# EAGLE design gotek_adapter (EAGLE 7.5.0)
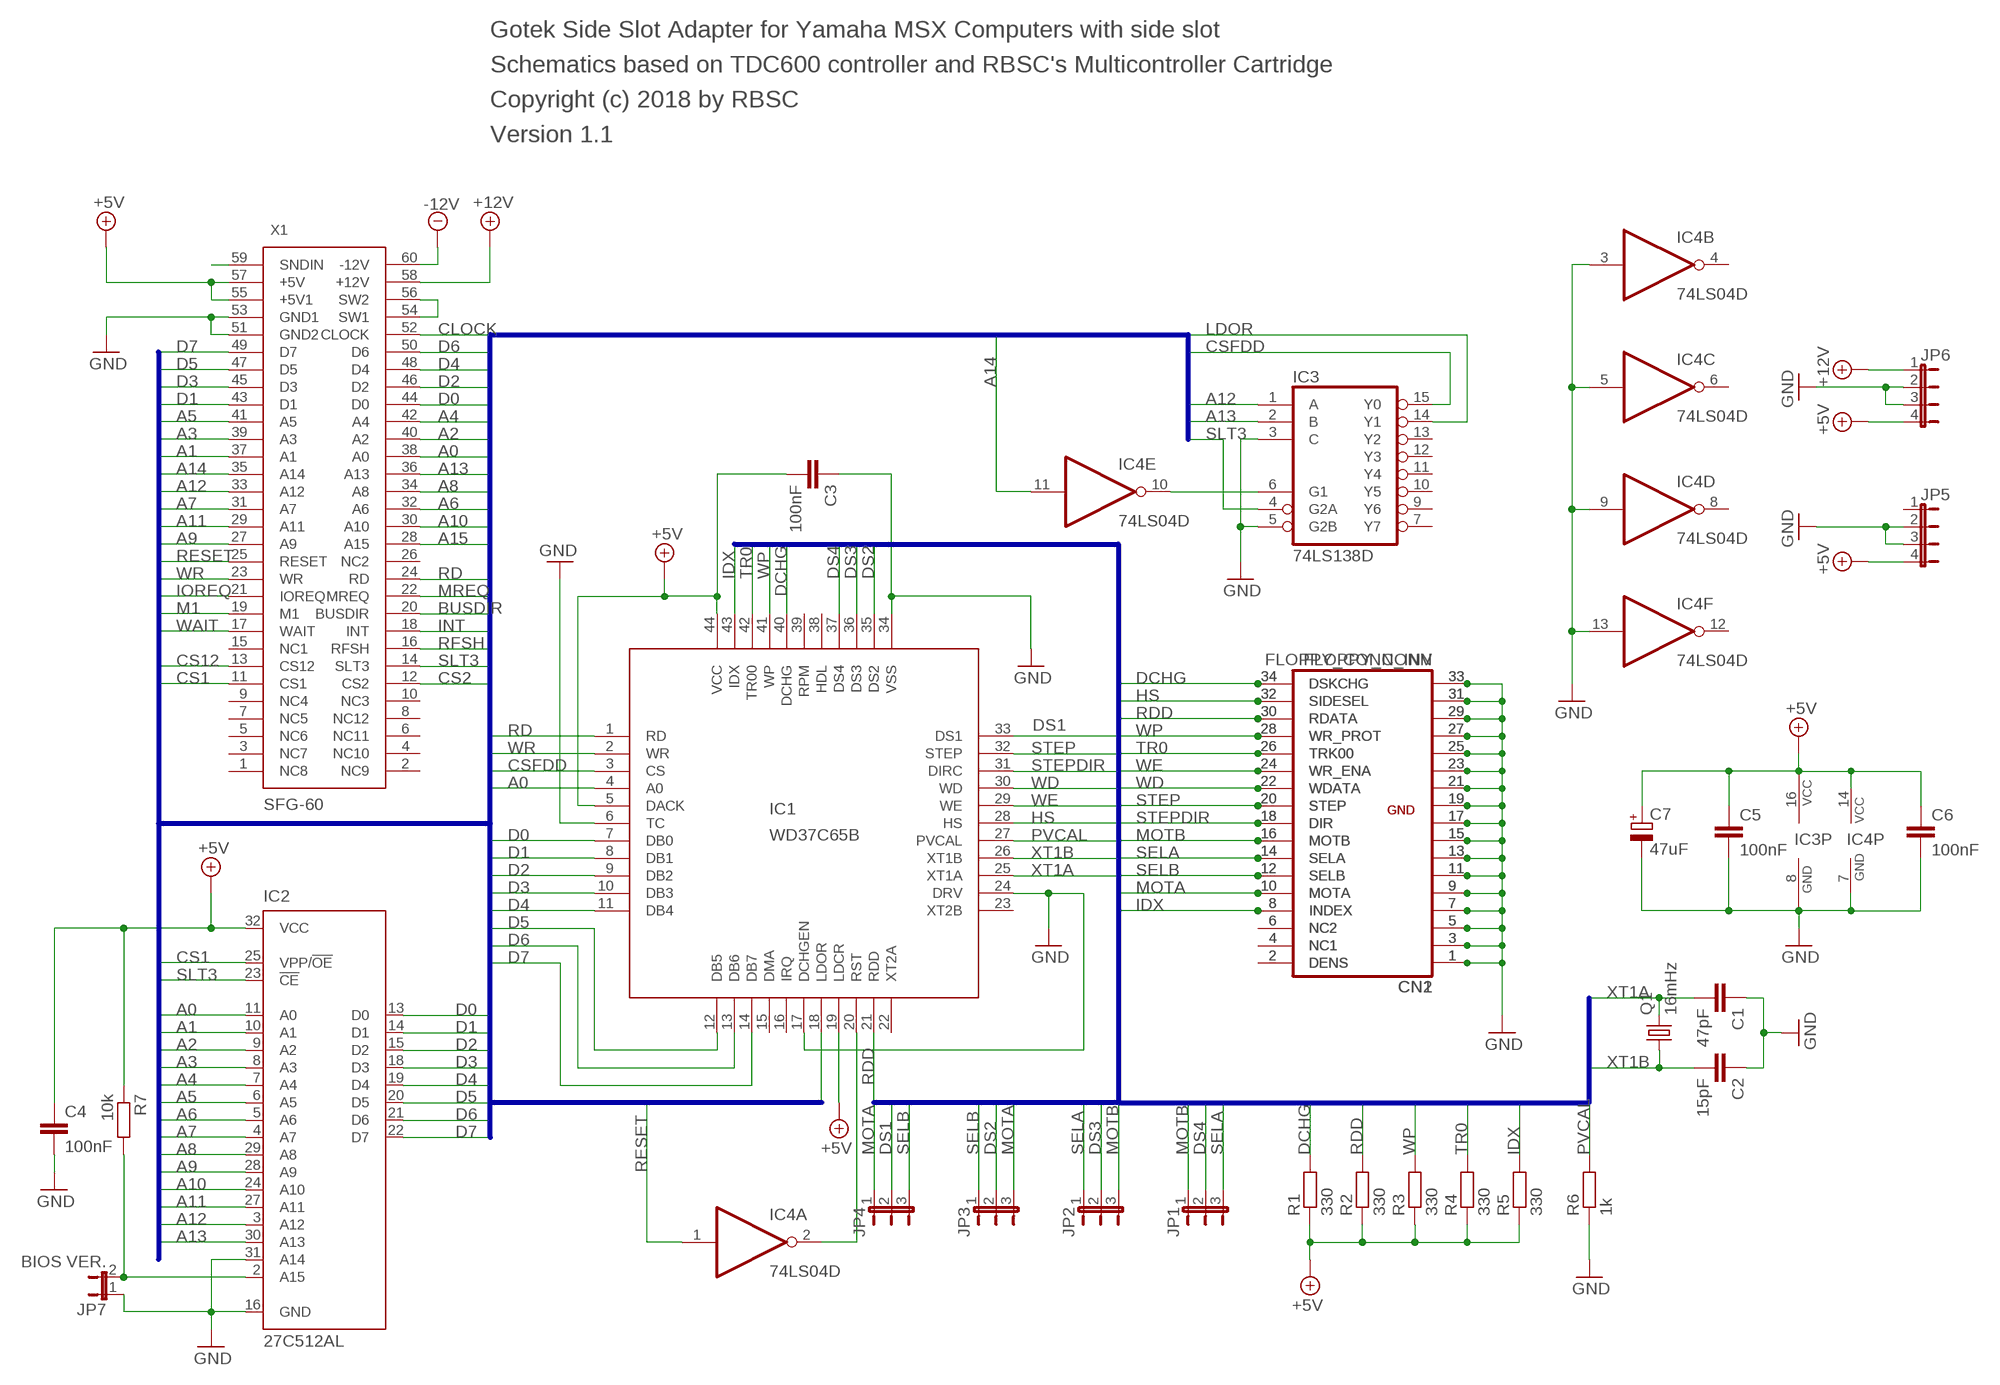
[diagram p0: schematic, sheet 1]

## Parts
C1  47pF  C-EUC0805  [C0805]
C2  15pF  C-EUC0805  [C0805]
C3  100nF  C-EUC0805  [C0805]
C4  100nF  C-EUC0805  [C0805]
C5  100nF  C-EUC0805  [C0805]
C6  100nF  C-EUC0805  [C0805]
C7  47uF  CPOL-EUSMCD  [SMC_D]
CN1  FLOPPY_CONN  [FL_CONN]
CN2  FLOPPY_CONN_INV  [FL_CONN]
IC1  WD37C65B  [PLCC44]
IC2  27C512AL  [PLCC-32]
IC3  74LS138D  [SO16]
IC4  74LS04D  [SO14]
JP1  JP2E  [JP2]
JP2  JP2E  [JP2]
JP3  JP2E  [JP2]
JP4  JP2E  [JP2]
JP5  JP4E  [JP4]
JP6  JP4E  [JP4]
JP7  BIOS VER.  JP1E  [JP1]
Q1  16mHz  CRYSTALHC49S  [HC49/S]
R1  330  R-EU_R0805  [R0805]
R2  330  R-EU_R0805  [R0805]
R3  330  R-EU_R0805  [R0805]
R4  330  R-EU_R0805  [R0805]
R5  330  R-EU_R0805  [R0805]
R6  1k  R-EU_R0805  [R0805]
R7  10k  R-EU_R0805  [R0805]
X1  SFG-60  [SFG-60]

## Nets
+5V: C3.2 C4.1 C5.1 C6.1 C7.+ IC1.5(DACK) IC1.19(LDCR) IC1.44(VCC) IC2.32(VCC) IC3.16(VCC) IC4.14(P:VCC) JP5.4 JP6.4 R1.1 R2.1 R3.1 R4.1 R5.1 R7.1 X1.55(+5V1) X1.57(+5V)
+12V: JP6.1 X1.58(+12V)
-12V: X1.60(-12V)
A0: IC1.4(A0) IC2.11(A0) X1.38(A0)
A1: IC2.10(A1) X1.37(A1)
A2: IC2.9(A2) X1.40(A2)
A3: IC2.8(A3) X1.39(A3)
A4: IC2.7(A4) X1.42(A4)
A5: IC2.6(A5) X1.41(A5)
A6: IC2.5(A6) X1.32(A6)
A7: IC2.4(A7) X1.31(A7)
A8: IC2.29(A8) X1.34(A8)
A9: IC2.28(A9) X1.27(A9)
A10: IC2.24(A10) X1.30(A10)
A11: IC2.27(A11) X1.29(A11)
A12: IC2.3(A12) IC3.1(A) X1.33(A12)
A13: IC2.30(A13) IC3.2(B) X1.36(A13)
A14: IC4.11(E:I) X1.35(A14)
A15: X1.28(A15)
BUSDIR: X1.20(BUSDIR)
CLOCK: X1.52(CLOCK)
CS1: IC2.25(VPP/!OE) X1.11(CS1)
CS2: X1.12(CS2)
CS12: X1.13(CS12)
CSFDD: IC1.3(CS) IC3.15(Y0)
D0: IC1.7(DB0) IC2.13(D0) X1.44(D0)
D1: IC1.8(DB1) IC2.14(D1) X1.43(D1)
D2: IC1.9(DB2) IC2.15(D2) X1.46(D2)
D3: IC1.10(DB3) IC2.18(D3) X1.45(D3)
D4: IC1.11(DB4) IC2.19(D4) X1.48(D4)
D5: IC1.12(DB5) IC2.20(D5) X1.47(D5)
D6: IC1.13(DB6) IC2.21(D6) X1.50(D6)
D7: IC1.14(DB7) IC2.22(D7) X1.49(D7)
DCHG: CN1.34(DSKCHG) CN2.34(DSKCHG) IC1.40(DCHG) R1.2
DS1: IC1.33(DS1) JP4.2
DS2: IC1.35(DS2) JP3.2
DS3: IC1.36(DS3) JP2.2
DS4: IC1.37(DS4) JP1.2
GND: C1.1 C2.1 C3.1 C4.2 C5.2 C6.2 C7.- CN1.1 CN1.3 CN1.5 CN1.7 CN1.9 CN1.11 CN1.13 CN1.15 CN1.17 CN1.19 CN1.21 CN1.23 CN1.25 CN1.27 CN1.29 CN1.31 CN1.33 CN2.1 CN2.3 CN2.5 CN2.7 CN2.9 CN2.11 CN2.13 CN2.15 CN2.17 CN2.19 CN2.21 CN2.23 CN2.25 CN2.27 CN2.29 CN2.31 CN2.33 IC1.6(TC) IC1.17(DCHGEN) IC1.24(DRV) IC1.34(VSS) IC2.16(GND) IC2.31(A14) IC3.3(C) IC3.5(G2B) IC3.8(GND) IC4.3(B:I) IC4.5(C:I) IC4.7(P:GND) IC4.9(D:I) IC4.13(F:I) JP5.2 JP5.3 JP6.2 JP6.3 JP7.1 R6.1 X1.51(GND2) X1.53(GND1)
HS: CN1.32(SIDESEL) CN2.32(SIDESEL) IC1.28(HS)
IDX: CN1.8(INDEX) CN2.8(INDEX) IC1.43(IDX) R5.2
INT: X1.18(INT)
IOREQ: X1.21(IOREQ)
LDOR: IC1.18(LDOR) IC3.14(Y1)
M1: X1.19(M1)
MOTA: CN1.10(MOTA) CN2.10(MOTA) JP3.3 JP4.1
MOTB: CN1.16(MOTB) CN2.16(MOTB) JP1.1 JP2.3
MREQ: X1.22(MREQ)
N$1: IC1.20(RST) IC4.2(A:O)
N$2: IC3.6(G1) IC4.10(E:O)
N$3: X1.54(SW1) X1.56(SW2)
N$4: CN1.2(DENS) CN2.2(DENS)
N$5: X1.59(SNDIN)
N$6: IC2.2(A15) JP7.2 R7.2
N$7: CN1.4(NC1) CN2.4(NC1)
N$8: CN1.6(NC2) CN2.6(NC2)
PVCAL: IC1.27(PVCAL) R6.2
RD: IC1.1(RD) X1.24(RD)
RDD: CN1.30(RDATA) CN2.30(RDATA) IC1.21(RDD) R2.2
RESET: IC4.1(A:I) X1.25(RESET)
RFSH: X1.16(RFSH)
SELA: CN1.14(SELA) CN2.14(SELA) JP1.3 JP2.1
SELB: CN1.12(SELB) CN2.12(SELB) JP3.1 JP4.3
SLT3: IC2.23(!CE) IC3.4(G2A) X1.14(SLT3)
STEP: CN1.20(STEP) CN2.20(STEP) IC1.32(STEP)
STEPDIR: CN1.18(DIR) CN2.18(DIR) IC1.31(DIRC)
TR0: CN1.26(TRK00) CN2.26(TRK00) IC1.42(TR00) R4.2
WAIT: X1.17(WAIT)
WD: CN1.22(WDATA) CN2.22(WDATA) IC1.30(WD)
WE: CN1.24(WR_ENA) CN2.24(WR_ENA) IC1.29(WE)
WP: CN1.28(WR_PROT) CN2.28(WR_PROT) IC1.41(WP) R3.2
WR: IC1.2(WR) X1.23(WR)
XT1A: C1.2 IC1.25(XT1A) Q1.2
XT1B: C2.2 IC1.26(XT1B) Q1.1
Unconnected: IC1.15(DMA) IC1.16(IRQ) IC1.22(XT2A) IC1.23(XT2B) IC1.38(HDL) IC1.39(RPM) IC3.7(Y7) IC3.9(Y6) IC3.10(Y5) IC3.11(Y4) IC3.12(Y3) IC3.13(Y2) IC4.4(B:O) IC4.6(C:O) IC4.8(D:O) IC4.12(F:O) JP5.1 X1.1(NC8) X1.2(NC9) X1.3(NC7) X1.4(NC10) X1.5(NC6) X1.6(NC11) X1.7(NC5) X1.8(NC12) X1.9(NC4) X1.10(NC3) X1.15(NC1) X1.26(NC2)

## Buses
D0,D1,D2,D3,D4,D5,D6,D7,A0,A1,A2,A3,A4,A5,A6,A7,A8,A9,A10,A11,A12,A13,A14,A15,CS1,CS2,CS12,SLT3,RFSH,WAIT,INT,M1,BUSDIR,IOREQ,MREQ,WR,RD,RESET,GND,CLOCK,SW1,SW2,CS,ROMCE,CSFDD,LDOR,A14INV
IDX,DCHG,HS,RDD,WP,TR0,WE,WD,STEP,STEPDIR,DS4,DS1,DS2,DS3,MOTOR,XT1A,XT1B,MOTA,MOTB,SELA,SELB,PVCAL

## Notes on the sheet
- Gotek Side Slot Adapter for Yamaha MSX Computers with side slot
- Schematics based on TDC600 controller and RBSC's Multicontroller Cartridge
- Copyright (c) 2018 by RBSC
- Version 1.1

## Library data of the parts
C1-C6 = rcl:C-EU: CAPACITOR, European symbol
C7 = rcl:CPOL-EU: POLARIZED CAPACITOR, European symbol
CN1 = floppy_connector:FLOPPY_CONN: Floppy interface old style
CN2 = floppy_connector_inv:FLOPPY_CONN_INV: Floppy interface old style
IC1 = wd37c65b:WD37C65B: WD37C65B Floppy disk controller
IC2 = microchip:27*512A: CMOS EPROM 512 K (64 K x 8); MPN: M27C512-90C1; OC_FARNELL: 1218315; OC_NEWARK: 24M5090
IC3 = 0RB_TTL:74*138: 3-line to 8-line DECODER/DEMULTIPLEXER
IC4 = 74xx-eu:74*04: Hex INVERTER
JP1-JP4 = jumper:JP2E: JUMPER
JP5 JP6 = jumper:JP4E: JUMPER
JP7 = jumper:JP1E: JUMPER
Q1 = crystal:CRYSTAL: CRYSTAL; OC_FARNELL: 1667008; OC_NEWARK: unknown
R1-R7 = rcl:R-EU_: RESISTOR, European symbol
X1 = sfg-60:SFG-60: 60-pin connector side slot

## Board
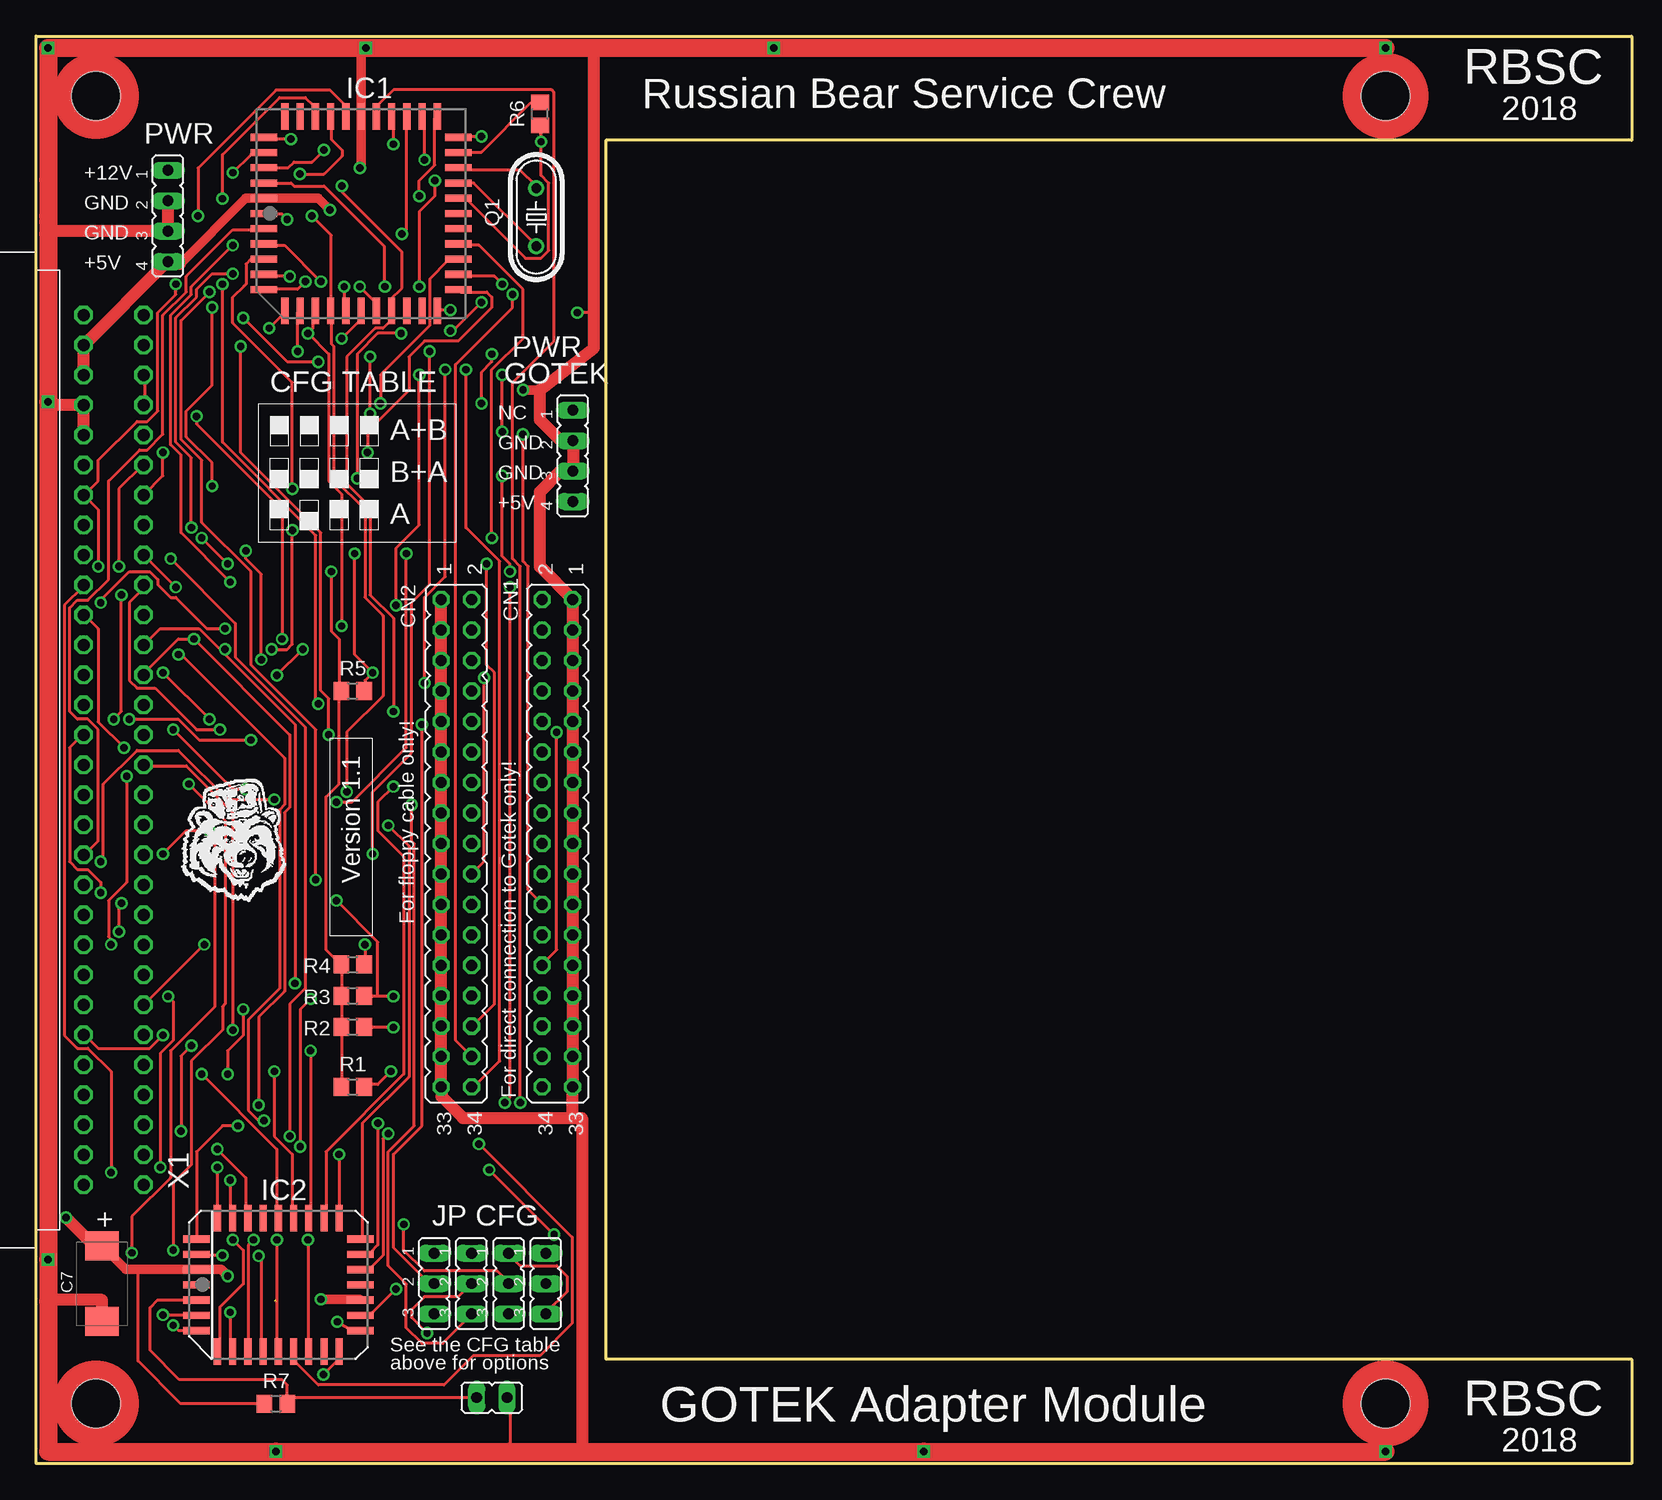
[diagram p1: board, top side]
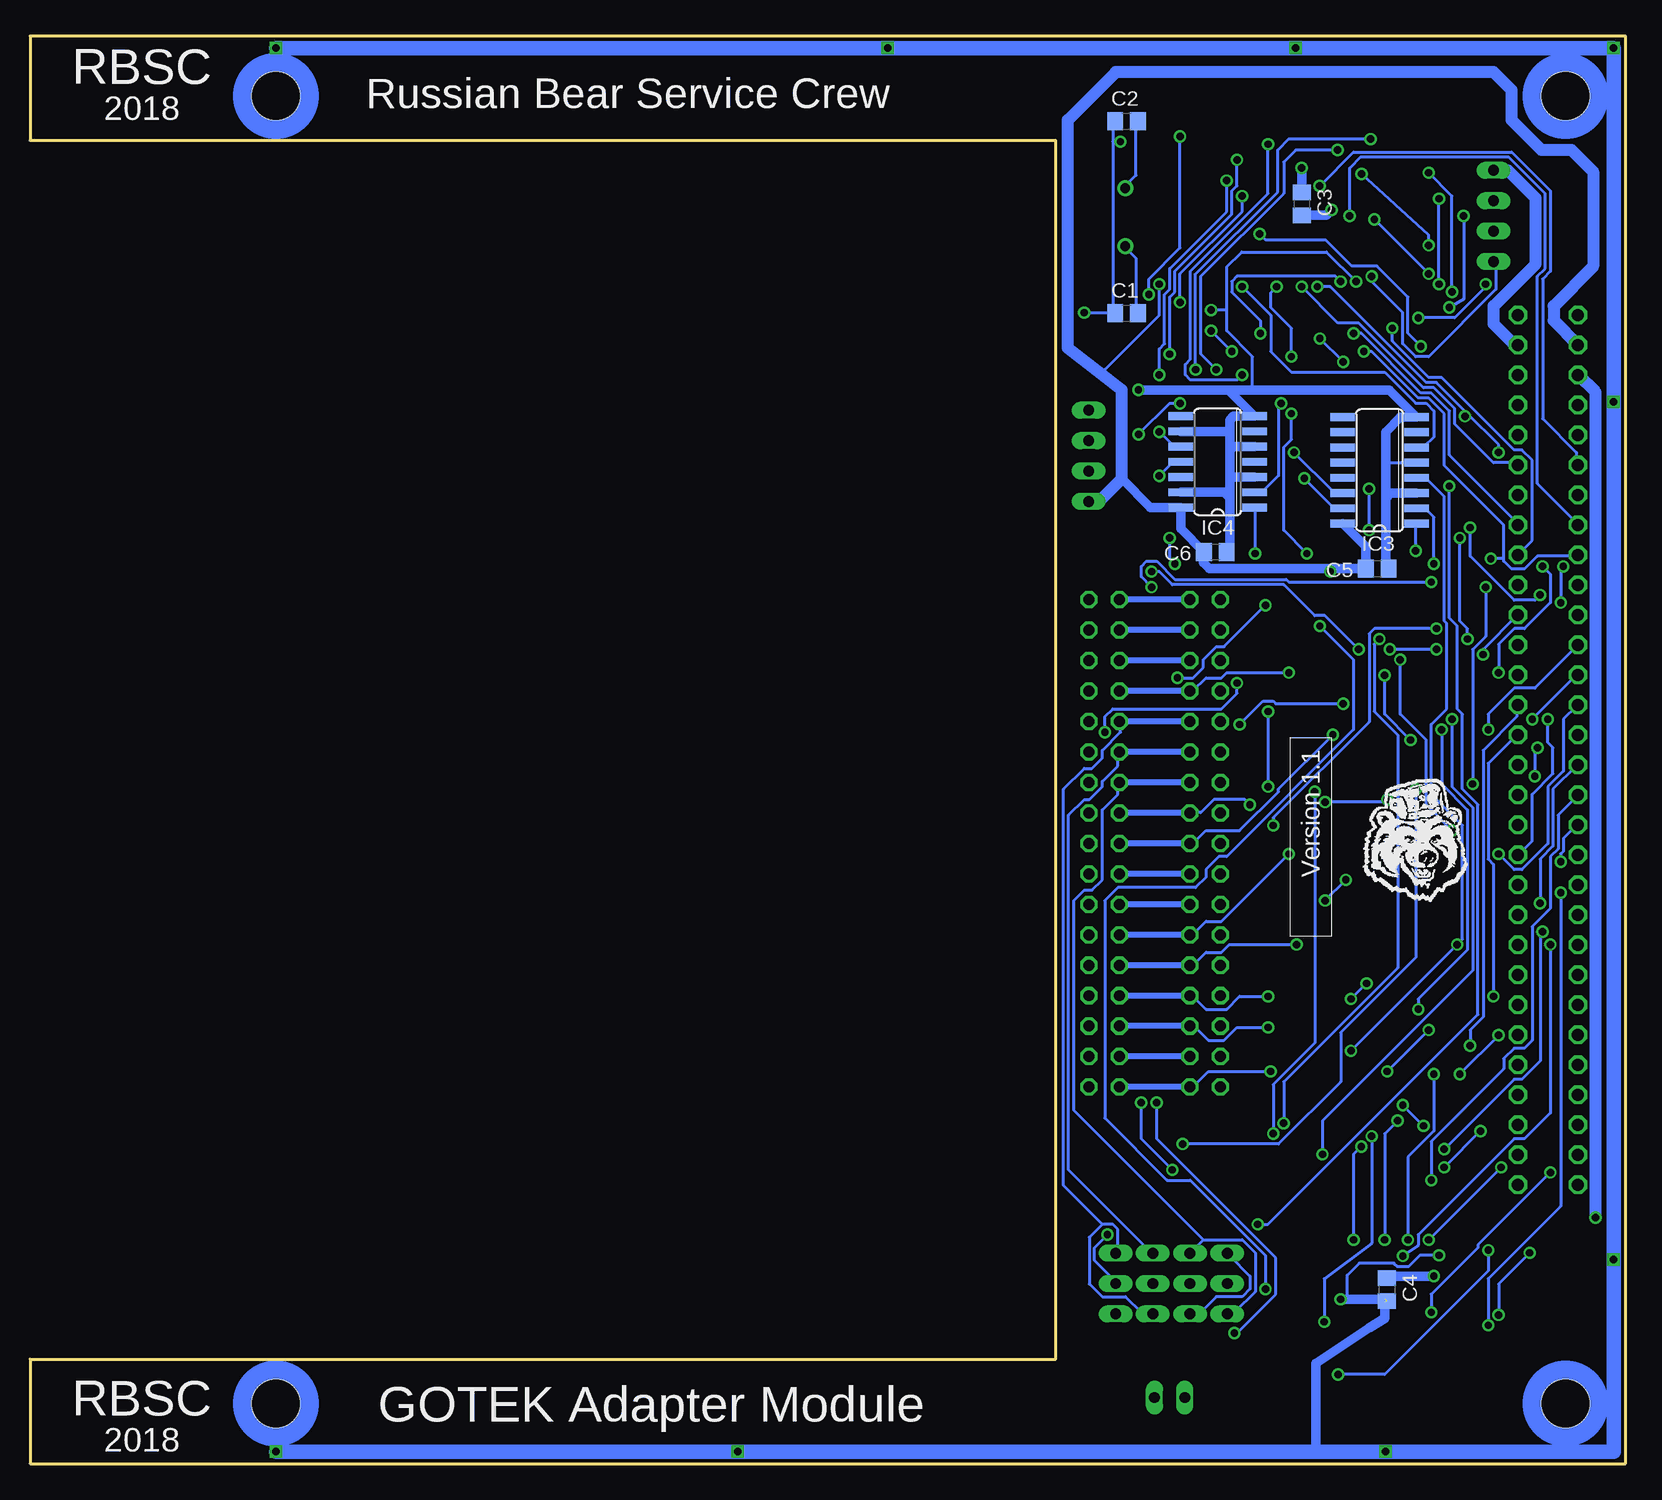
[diagram p2: board, bottom side, seen from below]

Size 133 x 119 mm. Coordinates in mm from the lower left corner, seen from the top.
Outline: 0,0 0,119 133,119 133,110.3 47.5,110.3 47.5,8.7 133,8.7 133,0 0,0
Copper layers (1*16): Top 0.035mm / dielectric 1.5mm / Bottom 0.035mm
Design rules "default *": minimum track width 10mil, minimum drill 24mil, track to track 7mil, track to pad 8mil, pad to pad 8mil, via to via 8mil, smd to smd 8mil, copper to edge 4mil, drill to drill 8mil, minimum pad ring 10mil, minimum via ring 8mil, stop-mask expansion 4mil, vias tented up to drill 24mil, thermal gap 10mil
Holes 4 mm at 5,114 5,5 112.5,114 112.5,5

### Footprints (pad centres in the part's own frame; a part is rotated, then mirrored left to right if it is on the bottom)
C0805 = smd 1.3 x 1.5: 1 -0.95,0; 2 0.95,0
SMC_D = smd 2.4 x 2.8: + -3.15,0; - 3.15,0
FL_CONN = drill 0.914 octagon: 1 -7.62,1.27; 2 -7.62,-1.27; 3 -5.08,1.27; 4 -5.08,-1.27; 5 -2.54,1.27; 6 -2.54,-1.27; 7 0,1.27; 8 0,-1.27; 9 2.54,1.27; 10 2.54,-1.27; 11 5.08,1.27; 12 5.08,-1.27; 13 7.62,1.27; 14 7.62,-1.27; 15 10.16,1.27; 16 10.16,-1.27; 17 12.7,1.27; 18 12.7,-1.27; 19 15.24,1.27; 20 15.24,-1.27; 21 17.78,1.27; 22 17.78,-1.27; 23 20.32,1.27; 24 20.32,-1.27; 25 22.86,1.27; 26 22.86,-1.27; 27 25.4,1.27; 28 25.4,-1.27; 29 27.94,1.27; 30 27.94,-1.27; 31 30.48,1.27; 32 30.48,-1.27; 33 33.02,1.27; 34 33.02,-1.27
FL_CONN' = drill 0.914 octagon: 1 -7.62,-1.27; 2 -7.62,1.27; 3 -5.08,-1.27; 4 -5.08,1.27; 5 -2.54,-1.27; 6 -2.54,1.27; 7 0,-1.27; 8 0,1.27; 9 2.54,-1.27; 10 2.54,1.27; 11 5.08,-1.27; 12 5.08,1.27; 13 7.62,-1.27; 14 7.62,1.27; 15 10.16,-1.27; 16 10.16,1.27; 17 12.7,-1.27; 18 12.7,1.27; 19 15.24,-1.27; 20 15.24,1.27; 21 17.78,-1.27; 22 17.78,1.27; 23 20.32,-1.27; 24 20.32,1.27; 25 22.86,-1.27; 26 22.86,1.27; 27 25.4,-1.27; 28 25.4,1.27; 29 27.94,-1.27; 30 27.94,1.27; 31 30.48,-1.27; 32 30.48,1.27; 33 33.02,-1.27; 34 33.02,1.27
PLCC44 = smd 0.6 x 2.2: 1 0,8.1; 2 -1.27,8.1; 3 -2.54,8.1; 4 -3.81,8.1; 5 -5.08,8.1; 6 -6.35,8.1; 18 -6.35,-8.1; 19 -5.08,-8.1; 20 -3.81,-8.1; 21 -2.54,-8.1; 22 -1.27,-8.1; 23 0,-8.1; 24 1.27,-8.1; 25 2.54,-8.1; 26 3.81,-8.1; 27 5.08,-8.1; 28 6.35,-8.1; 40 6.35,8.1; 41 5.08,8.1; 42 3.81,8.1; 43 2.54,8.1; 44 1.27,8.1 | smd 2.2 x 0.6: 7 -8.1,6.35; 8 -8.1,5.08; 9 -8.1,3.81; 10 -8.1,2.54; 11 -8.1,1.27; 12 -8.1,0; 13 -8.1,-1.27; 14 -8.1,-2.54; 15 -8.1,-3.81; 16 -8.1,-5.08; 17 -8.1,-6.35; 29 8.1,-6.35; 30 8.1,-5.08; 31 8.1,-3.81; 32 8.1,-2.54; 33 8.1,-1.27; 34 8.1,0; 35 8.1,1.27; 36 8.1,2.54; 37 8.1,3.81; 38 8.1,5.08; 39 8.1,6.35
PLCC-32 = smd 2.2 x 0.6: 1 -6.83,0; 2 -6.83,-1.27; 3 -6.83,-2.54; 4 -6.83,-3.81; 14 6.83,-3.81; 15 6.83,-2.54; 16 6.83,-1.27; 17 6.83,0; 18 6.83,1.27; 19 6.83,2.54; 20 6.83,3.81; 30 -6.83,3.81; 31 -6.83,2.54; 32 -6.83,1.27 | smd 0.6 x 2.2: 5 -5.08,-5.56; 6 -3.81,-5.56; 7 -2.54,-5.56; 8 -1.27,-5.56; 9 0,-5.56; 10 1.27,-5.56; 11 2.54,-5.56; 12 3.81,-5.56; 13 5.08,-5.56; 21 5.08,5.56; 22 3.81,5.56; 23 2.54,5.56; 24 1.27,5.56; 25 0,5.56; 26 -1.27,5.56; 27 -2.54,5.56; 28 -3.81,5.56; 29 -5.08,5.56
SO16 = smd 0.66 x 2.032: 1 -4.445,-3.073; 2 -3.175,-3.073; 3 -1.905,-3.073; 4 -0.635,-3.073; 5 0.635,-3.073; 6 1.905,-3.073; 7 3.175,-3.073; 8 4.445,-3.073; 9 4.445,3.073; 10 3.175,3.073; 11 1.905,3.073; 12 0.635,3.073; 13 -0.635,3.073; 14 -1.905,3.073; 15 -3.175,3.073; 16 -4.445,3.073
SO14 = smd 0.66 x 2.032: 1 -3.81,-3.073; 2 -2.54,-3.073; 3 -1.27,-3.073; 4 0,-3.073; 5 1.27,-3.073; 6 2.54,-3.073; 7 3.81,-3.073; 8 3.81,3.073; 9 2.54,3.073; 10 1.27,3.073; 11 0,3.073; 12 -1.27,3.073; 13 -2.54,3.073; 14 -3.81,3.073
JP2 = drill 0.914 long: 1 -2.54,0; 2 0,0; 3 2.54,0
JP4 = drill 0.914 long: 1 -3.81,0; 2 -1.27,0; 3 1.27,0; 4 3.81,0
JP1 = drill 0.914 long: 1 0,-1.27; 2 0,1.27
HC49/S = drill 0.813: 1 -2.413,0; 2 2.413,0
R0805 = smd 1.3 x 1.5: 1 -0.95,0; 2 0.95,0
SFG-60 = drill 1 octagon: 1 -36.25,3.54; 2 -36.25,-1.46; 3 -33.75,3.54; 4 -33.75,-1.46; 5 -31.25,3.54; 6 -31.25,-1.46; 7 -28.75,3.54; 8 -28.75,-1.46; 9 -26.25,3.54; 10 -26.25,-1.46; 11 -23.75,3.54; 12 -23.75,-1.46; 13 -21.25,3.54; 14 -21.25,-1.46; 15 -18.75,3.54; 16 -18.75,-1.46; 17 -16.25,3.54; 18 -16.25,-1.46; 19 -13.75,3.54; 20 -13.75,-1.46; 21 -11.25,3.54; 22 -11.25,-1.46; 23 -8.75,3.54; 24 -8.75,-1.46; 25 -6.25,3.54; 26 -6.25,-1.46; 27 -3.75,3.54; 28 -3.75,-1.46; 29 -1.25,3.54; 30 -1.25,-1.46; 31 1.25,3.54; 32 1.25,-1.46; 33 3.75,3.54; 34 3.75,-1.46; 35 6.25,3.54; 36 6.25,-1.46; 37 8.75,3.54; 38 8.75,-1.46; 39 11.25,3.54; 40 11.25,-1.46; 41 13.75,3.54; 42 13.75,-1.46; 43 16.25,3.54; 44 16.25,-1.46; 45 18.75,3.54; 46 18.75,-1.46; 47 21.25,3.54; 48 21.25,-1.46; 49 23.75,3.54; 50 23.75,-1.46; 51 26.25,3.54; 52 26.25,-1.46; 53 28.75,3.54; 54 28.75,-1.46; 55 31.25,3.54; 56 31.25,-1.46; 57 33.75,3.54; 58 33.75,-1.46; 59 36.25,3.54; 60 36.25,-1.46

### Placement (x,y rotation side)
C1  41.6,95.9 0 bottom
C2  41.6,111.9 0 bottom
C3  27,105 270 bottom
C4  19.9,14.5 270 bottom
C5  20.7,74.6 0 bottom
C6  34.2,76 0 bottom
C7  5.5,15 270 top
CN1  43.48,64.4 270 top
CN2  FLOPPY_CONN_INV  [FL_CONN']  35.03,64.4 270 top
IC1  27.1,104.2 90 top
IC2  20.2,14.9 0 top
IC3  20.5,82.8 90 bottom
IC4  34,83.5 90 bottom
JP1  33.2,15 270 top
JP2  36.3,15 270 top
JP3  39.4,15 270 top
JP4  42.5,15 270 top
JP5  44.75,84 270 top
JP6  11,104 270 top
JP7  38,5.5 90 top
Q1  41.7,103.9 270 top
R1  26.4,31.4 0 top
R2  26.4,36.4 0 top
R3  26.4,39 0 top
R4  26.4,41.6 0 top
R5  26.4,64.4 0 top
R6  42,112.5 90 top
R7  20,5 0 top
X1  7.5,59.5 90 top

### Tracks (layer width: path | path; a pad name or v marks a point on that pad's centre or on a via)
+5V  (via drill 0.6, 0.61)
  Top 0.254: R1.1 25.48,31.6 25.48,36.35 R2.1 25.48,36.57 25.48,38.94 R3.1 25.48,39.16 25.48,41.53 R4.1 25.26,41.75 24.18,42.83 24.18,55.57 25.26,56.65 25.26,64.2 R5.1 25.26,64.42 25.26,68.74 24.61,69.38 v24.61,74.35 | v38.86,98.31 38.21,98.96 35.41,98.96 IC1.19 | 8.5,16.17 8.5,8.55 12.05,5 R7.1 | v21.16,98.96 19,98.96 IC1.5
  Top 0.5: 11.2,100.39 JP6.4 11.19,100
  Top 0.8: 12,100 17.47,105.47 IC1.44 23.53,105.47 v24.5,104.5 | v15.98,15.62 15.43,16.17 IC2.32 8.5,16.17 7.48,16.17 C7.+
  Top 1: X1.57 4.25,93.25 | X1.55 X1.57 | JP6.4 10.9,100.19 X1.57 | 12,100 11.19,100 | v2.5,20.5 4.85,18.15 C7.+
  Bottom 0.254: 19.86,15.62 C4.1 | JP6.4 10.79,100.04 10.79,97.88 16.41,92.27 17.49,92.27 18.57,93.35 18.57,95.94 21.37,98.75 v21.16,98.96 | v38.86,98.31 38.86,95.72 43.4,91.19 43.69,90.81 | v24.61,74.35 24.61,74.6
  Bottom 0.8: 42,82.1 39.59,79.69 IC4.14 37.07,77.92 C6.1 35.2,75.95 35.2,75.1 34.7,74.6 24.61,74.6 C5.1 21.65,76.43 IC3.16 | v15.98,15.62 19.86,15.62 | C3.2 24.95,104.05 v24.5,104.5
  Bottom 1: X1.57 6,95.29 6,96.5 2.7,99.8 2.7,107.7 4.5,109.5 7,109.5 9.5,112 9.5,114.5 11,116 42.5,116 46.5,112 46.5,93 43.69,90.81 42,89.5 42,82.1 43.91,80.19 JP5.4 45.11,80.19 | v2.5,20.5 2.5,89.3 X1.55
+12V
  Bottom 1: X1.58 9.25,93.25 11,95 11,96.5 7.5,100 7.5,105.5 9.81,107.81 JP6.1
A0  (via drill 0.61)
  Top 0.254: v22.67,18.65 22.67,9.36 IC2.11 | v22.02,26.42 22.02,37.86 v22.89,38.73 | v21.59,40.02 21.59,61.61 15.54,67.66 | 15.54,67.66 13.6,69.6 10.36,69.6 9.07,68.3 X1.38 | v21.37,81.26 21.37,90.11 16.41,95.08 16.41,97.23 17.34,98.16 17.5,98.33 17.5,100 17.89,100.39 IC1.4 | v21.37,77.8 21.37,68.3 20.94,67.87 v19.65,67.87 | 15.54,67.66 v15.76,67.87
  Bottom 0.254: v22.67,18.65 22.67,25.77 v22.02,26.42 | v21.59,40.02 v22.89,38.73 | v21.37,77.8 v21.37,81.26 | v15.76,67.87 v19.65,67.87
A1  (via drill 0.61)
  Top 0.254: v36.92,26.64 44.69,18.86 44.69,11.69 42,9 36.44,9 34,6.56 23.53,6.56 21.59,8.5 21.59,9.15 IC2.10 | v17.49,56.21 16.41,56.21 v11.44,61.18
  Bottom 0.254: v36.92,26.64 28.93,26.64 23.75,31.82 23.75,35.92 17.49,42.18 v17.49,56.21 | v11.44,61.18 11.44,62.48 9.28,64.63 7.56,64.63 4.1,68.09 X1.37
A2  (via drill 0.61)
  Top 0.254: v20.08,18.65 20.08,9.36 IC2.9 | v19,28.58 18.57,28.58 17.7,29.44 17.7,37 20.3,39.59 20.3,54.49 20.73,54.92 20.73,58.8 12.09,67.44 v11.87,67.44
  Bottom 0.254: v20.08,18.65 20.08,27.5 v19,28.58 | v11.87,67.44 11.87,67.87 9.07,70.68 X1.40
A3  (via drill 0.61)
  Top 0.254: v18.57,17.3 18.78,16.99 18.78,9.36 IC2.8 | v6.26,43.26 6.26,43.69 6.04,43.91 6.04,46.93 7.56,48.44 v7.56,57.29 | v7.34,59.67 5.18,61.83 5.18,69.6 4.1,70.68 X1.39
  Bottom 0.254: v18.57,17.3 17.27,18.2 17.27,19.08 9.28,27.07 8.42,27.07 6.26,29.23 v6.26,43.26 | v7.56,57.29 7.56,59.45 v7.34,59.67
A4  (via drill 0.61)
  Top 0.254: v18.14,18.65 17.7,18.21 17.7,9.36 IC2.7 | v15.98,32.47 15.98,34.41 17.27,35.7 v17.27,37.86 | v15.33,61.18 13.39,61.18 9.93,64.63 8.42,64.63 7.77,65.28 7.77,71.76 9.07,73.05 X1.42
  Bottom 0.254: v18.14,18.65 18.14,25.56 15.98,27.71 v15.98,32.47 | v17.27,37.86 17.27,38.73 13.17,42.83 13.17,54.49 15.33,56.65 v15.33,61.18
A5  (via drill 0.61)
  Top 0.254: v16.19,12.6 16.19,9.36 IC2.6 | v6.26,24.26 6.26,32.68 4.32,34.62 3.45,34.62 2.38,35.7 2.38,71.54 3.89,73.05 X1.41
  Bottom 0.254: v16.19,12.6 16.19,14.11 12.31,18 12.31,18.21 v6.26,24.26
A6  (via drill 0.61)
  Top 0.254: v16.41,18.65 17.27,17.78 17.27,14.98 15.33,13.03 15.33,9.36 IC2.5 | v10.36,24.69 10.36,34.19 11.44,35.27 11.44,38.51 v11.01,38.94
  Bottom 0.254: v10.36,24.69 v16.41,18.65 | v11.01,38.94 11.01,49.95 11.44,50.38 11.44,58.37 9.07,60.75 X1.32
A7  (via drill 0.61)
  Top 0.254: v11.44,11.52 11.87,11.09 13.17,11.09 IC2.4 | v5.4,47.58 5.4,48.44 4.32,49.52 3.45,49.52 2.81,50.17 2.81,59.67 3.89,60.75 X1.31
  Bottom 0.254: v11.44,11.52 11.44,15.41 5.4,21.45 v5.4,47.58
A8  (via drill 0.61)
  Top 0.254: v15.11,24.69 15.11,20.59 IC2.29 | v12.09,27.71 12.09,33.98 v12.95,34.84
  Bottom 0.254: v12.09,27.71 v15.11,24.69 | v12.95,34.84 12.95,36.13 11.87,37.21 11.87,59.45 9.07,62.26 9.07,63.12 X1.34
A9  (via drill 0.61)
  Top 0.254: v16.19,23.61 16.19,20.59 IC2.28
  Bottom 0.254: v16.19,23.61 16.19,26.85 10.15,32.9 10.15,33.76 9.28,34.62 8.42,34.62 7.77,35.27 7.77,44.77 6.26,46.28 6.26,50.6 5.61,51.25 5.61,54.05 4.1,55.57 X1.27
A10  (via drill 0.61)
  Top 0.254: v19.86,32.68 19.86,27.28 21.37,25.77 21.37,20.59 IC2.24 | v16.41,36.13 16.41,54.27 12.52,58.16 9.07,58.16 X1.30
  Bottom 0.254: v16.41,36.13 v19.86,32.68
A11  (via drill 0.61)
  Top 0.254: v15.11,26.2 17.49,23.83 17.49,20.59 IC2.27 | v6.91,44.34 6.91,46.5 v7.12,46.71
  Bottom 0.254: v15.11,26.2 9.28,32.03 8.64,32.03 7.12,33.54 7.12,44.12 v6.91,44.34 | v7.12,46.71 7.12,50.38 6.04,51.46 6.04,56.21 4.1,58.16 X1.29
A12  (via drill 0.61)
  Top 0.254: v17.49,76.08 17.49,75.43 18.78,74.13 v18.78,67.01 | v10.58,50.82 12.52,52.76 v14.46,52.76 14.9,52.33 14.9,38.08 11.23,34.41 11.23,23.83 7.99,20.59 v7.99,17.57 | v10.58,12.39 13.17,12.39 IC2.3
  Bottom 0.254: v17.49,76.08 17.49,78.23 IC3.1 | v18.78,67.01 18.78,62.48 16.62,60.32 16.62,54.92 v14.46,52.76 | v10.58,50.82 9.28,49.52 8.64,49.52 6.48,51.68 6.48,56.43 5.18,57.73 5.18,62.04 4.1,63.12 X1.33 | v10.58,12.39 10.58,14.98 v7.99,17.57
A13  (via drill 0.61)
  Top 0.254: v13.82,77.16 v15.98,75 | X1.36 9.07,65.93 11.87,68.74 v13.17,68.74 21.16,60.75 21.16,54.7 20.73,54.27 20.73,39.37 18.57,37.21 v18.57,29.87 | v16.84,28.15 15.54,28.15 13.39,25.99 13.39,18.86 IC2.30
  Bottom 0.254: v15.98,75 15.98,78.88 16.62,79.53 17.27,79.53 IC3.2 | v13.82,77.16 13.82,70.25 13.17,69.6 v13.17,68.74 | v18.57,29.87 v16.84,28.15
A14  (via drill 0.61)
  Top 0.254: v38.86,82.34 38.86,75.64 39.51,75 v39.51,74.35 | v20.08,65.71 v22.24,67.87 | v17.92,60.32 13.6,60.32 11.87,62.04 v7.77,62.04
  Bottom 0.254: v38.86,82.34 37.78,83.42 37.13,83.42 IC4.11 | v39.51,74.35 38.86,74.35 37.78,73.27 28.5,73.27 25.91,70.68 25.04,70.68 v22.24,67.87 | v20.08,65.71 20.08,62.48 v17.92,60.32 | v7.77,62.04 4.1,65.71 X1.35
CS1  (via drill 0.61)
  Top 0.254: v13.82,32.47 20.08,26.2 20.08,20.59 IC2.25 | v10.58,35.7 9.5,34.62 5.18,34.62 4.1,35.7 X1.11
  Bottom 0.254: v10.58,35.7 v13.82,32.47
CSFDD  (via drill 0.61)
  Top 0.254: v26.77,82.12 26.77,92.48 28.5,94.21 v30.44,94.21 | v23.75,98.53 20.73,101.55 19.21,101.55 IC1.3
  Bottom 0.254: v26.77,82.12 24.4,79.75 23.75,79.75 IC3.15 | v30.44,94.21 30.44,95.29 32.82,97.67 32.82,98.53 32.38,98.96 24.18,98.96 v23.75,98.53
D0  (via drill 0.61)
  Top 0.254: v19.43,94.64 20.73,95.94 IC1.7 | v23.96,7.42 25.26,8.72 25.26,9.15 IC2.13 | v11.44,17.78 11.44,23.4 12.95,24.91 12.95,33.54 15.54,36.13 15.54,38.08 15.76,38.29 15.76,53.62 v12.74,56.65 | v11.66,73.05 9.07,75.64 X1.44
  Bottom 0.254: v19.43,94.64 19.43,93.56 16.41,90.54 15.33,90.54 9.28,84.5 8.64,84.5 7.77,83.63 7.77,76.94 8.85,75.86 X1.44 | v23.96,7.42 20.08,7.42 11.44,16.06 v11.44,17.78 | v12.74,56.65 12.74,67.87 11.66,68.95 v11.66,73.05
D1  (via drill 0.61)
  Top 0.254: v21.81,92.7 21.81,95.94 IC1.8 | v25.11,11.82 26.34,11.09 26.99,11.09 IC2.14 | v21.16,27.28 21.16,38.29 22.45,39.59 22.45,61.4 16.62,67.22 16.62,70.03 v11.23,75.43
  Bottom 0.254: v21.81,92.7 21.16,92.7 17.27,88.81 16.41,88.81 15.11,87.52 15.11,83.2 10.15,78.23 10.15,75.43 | 10.15,75.43 10.15,75.21 9.5,74.56 8.42,74.56 7.34,75.64 4.1,75.64 X1.43 | v25.11,11.82 25.11,15.41 21.16,18.36 v21.16,27.28 | 10.15,75.43 v11.23,75.43
D2  (via drill 0.61)
  Top 0.254: IC1.9 23.1,95.94 23.1,94.64 v22.67,94.21 24.4,92.48 24.4,81.91 25.48,80.83 v25.48,69.81 | v30.01,14.54 27.85,12.39 27.2,12.39 IC2.15
  Bottom 0.254: v22.67,94.21 22.02,94.21 17.06,89.25 16.19,89.25 14.68,87.73 14.68,84.06 9.07,78.45 X1.46 | v30.01,14.54 30.01,17.35 36.27,23.61 38.21,23.61 43.4,28.79 43.4,46.93 42.32,48.01 35.84,48.01 34.98,48.87 34.98,49.52 33.9,50.6 33.25,50.6 22.67,61.18 22.67,67.01 v25.48,69.81
D3  (via drill 0.6, 0.61)
  Top 0.254: v29.36,27.5 28.93,27.07 28.93,17.35 27.85,16.27 27.2,16.27 IC2.18 | v25.91,56 25.91,60.96 28.93,63.99 28.93,70.68 27.42,72.19 27.42,79.53 24.83,82.12 24.83,93.13 24.61,93.35 24.61,95.94 IC1.10 24.61,96.16 24.61,102.39 v23,104
  Bottom 0.254: X1.45 4.1,78.45 7.34,81.69 7.34,98.96 6.69,99.61 6.69,105.87 9.72,108.89 22.11,108.89 23,108 v23,104 | v29.36,27.5 29.36,31.6 25.91,35.05 v25.91,56
D4  (via drill 0.61)
  Top 0.254: v25.69,98.1 25.69,96.16 IC1.11 | v10.58,84.28 10.58,82.34 9.07,80.83 X1.48 | v28.5,28.36 28.5,18.21 27.85,17.57 27.2,17.57 IC2.19 | v20.51,68.74 20.51,79.53 13.39,86.66 v13.39,87.3
  Bottom 0.254: v25.69,98.1 24.61,98.1 16.62,90.11 15.76,90.11 13.17,87.52 | 13.17,87.52 10.58,84.93 v10.58,84.28 | v28.5,28.36 28.5,31.82 19,41.32 19,60.75 20.94,62.69 20.94,68.3 v20.51,68.74 | 13.17,87.52 v13.39,87.3
D5  (via drill 0.61)
  Top 0.254: v29.36,53.19 31.09,51.46 31.09,32.25 27.2,28.36 27.2,18.86 IC2.20 | v15.76,69.6 14.25,69.6 11.66,72.19 11.23,72.19 10.15,73.27 10.15,73.7 9.5,74.35 7.77,74.35 5.4,71.97 v5.4,71.76 | v5.18,74.78 5.18,79.53 4.1,80.61 X1.47 4.1,80.83 5.18,81.91 5.18,83.63 8.42,86.87 9.28,86.87 10.15,87.73 10.15,95.94 11.66,97.45 v11.66,98.31 | v25.48,93.78 26.99,95.29 26.99,95.94 IC1.12 | v23.53,91.84 20.94,91.84 v17.27,95.51
  Bottom 0.254: v29.36,53.19 29.36,53.84 21.37,61.83 21.37,69.17 20.94,69.6 v15.76,69.6 | v5.4,71.76 5.4,74.56 v5.18,74.78 | v23.53,91.84 v25.48,93.78 | v17.27,95.51 14.25,95.51 11.66,98.1 v11.66,98.31
D6  (via drill 0.61)
  Top 0.254: v25.26,25.77 25.26,20.59 IC2.21 | v10.58,65.93 v14.46,62.04 | v6.91,74.78 6.91,81.26 8.85,83.2 X1.50 | v26.99,98.1 28.28,96.8 28.28,96.16 IC1.13
  Bottom 0.254: v25.26,25.77 25.26,28.58 12.74,41.1 12.74,54.7 14.46,56.43 v14.46,62.04 | v10.58,65.93 10.58,68.3 9.28,69.6 8.42,69.6 6.26,71.76 6.26,74.13 v6.91,74.78 | v26.99,98.1 23.96,95.08 22.24,95.08 16.84,89.68 15.98,89.68 14.25,87.95 14.25,86.66 11.01,83.42 9.07,83.42 X1.50
D7  (via drill 0.6, 0.61)
  Top 0.254: v29.79,56.43 28.5,55.13 28.5,52.76 30.66,50.6 30.66,32.47 24.18,25.99 24.18,20.59 IC2.22 | v29.79,62.69 29.79,70.46 27.85,72.41 27.85,79.75 25.91,81.69 25.91,92.27 28.28,94.64 28.93,94.64 29.58,95.29 29.58,95.94 IC1.14 29.58,96.16 29.58,97.08 30.5,98 30.5,101 25.5,106 v25.5,106.5
  Bottom 0.254: v29.79,62.69 v29.79,56.43 | X1.49 4.1,83.42 4.1,84.28 6.91,87.09 6.91,98.75 6.26,99.39 6.26,106.09 9.5,109.33 22.68,109.33 v25.5,106.5
DCHG  (via drill 0.61)
  Top 0.254: v29.58,32.68 28.5,31.6 27.42,31.6 R1.2 | v21.25,110.4 19.21,110.4 IC1.40 | v35.84,91.19 35.84,78.02 38.65,75.21 38.65,33.54 36.49,31.38 CN2.34
  Bottom 0.254: v29.58,32.68 34.76,32.68 36.05,31.38 CN2.34 | v35.84,91.19 35.84,99.18 35.82,99.18 29,106 29,109.5 28.1,110.4 v21.25,110.4
  Bottom 0.5: CN2.34 CN1.34
DS1  (via drill 0.61)
  Top 0.254: v40.37,30.09 40.37,74.78 39.73,75.43 39.73,90.11 43.18,93.56 43.18,114.29 42.96,114.51 29.79,114.51 28.5,113.21 28.5,112.35 IC1.33 | v43.18,19.08 v37.78,24.48
  Bottom 0.254: v40.37,30.09 40.37,27.07 v37.78,24.48 | v43.18,19.08 44.26,18 44.26,16.92 42.53,15.19 JP4.2
DS2  (via drill 0.6, 0.61)
  Top 0.254: v14.68,96.37 14.68,89.89 12.52,87.73 12.52,85.58 14.68,83.42 v14.68,81.47 | v30.66,19.94 30.66,17.78 32.38,16.06 38.43,16.06 39.29,15.19 JP3.2 | IC1.35 25.69,112.13 25.69,113.31 24.5,114.5 20,114.5 13.5,108 v13.5,104
  Bottom 0.254: v14.68,81.47 14.68,70.46 14.03,69.81 14.03,62.91 13.6,62.48 13.6,56.21 12.31,54.92 12.31,37.43 29.79,19.94 v30.66,19.94 | v13.5,104 13.5,97.05 v14.68,96.37
DS3  (via drill 0.6, 0.61)
  Top 0.254: v16.41,101.55 12.95,98.1 12.95,97.45 11.23,95.72 11.23,84.93 12.09,84.06 12.09,77.59 v16.19,73.49 | v39.51,73.05 39.51,30.52 v39.08,30.09 | v32.6,10.87 31.3,12.17 31.3,12.82 32.38,13.9 35.19,13.9 36.27,14.98 JP2.2 | v22,107.5 24,107.5 25.5,109 25.5,109.5 24.61,110.39 24.61,112.13 IC1.36 24.5,112.24
  Bottom 0.254: v16.19,73.49 28.07,73.49 28.28,73.7 37.57,73.7 39.08,75.21 39.94,75.21 40.37,74.78 40.37,73.92 v39.51,73.05 | v39.08,30.09 39.08,27.07 29.15,17.14 29.15,14.11 32.38,10.87 v32.6,10.87 | v16.41,101.55 16.41,102.41 v22,107.5
DS4  (via drill 0.61)
  Top 0.254: v15.54,105.44 15.54,109.11 20.3,113.86 22.45,113.86 23.1,113.21 23.1,112.35 IC1.37 | v15.54,98.31 15.54,85.14 23.32,77.37 23.32,63.55 v23.53,63.34 | v32.17,61.61 32.17,28.15 29.79,25.77 29.79,18 32.6,15.19 33.03,15.19 JP1.2
  Bottom 0.254: v15.54,98.31 v15.54,105.44 | v23.53,63.34 29.15,63.34 29.36,63.55 30.23,63.55 v32.17,61.61
GND  (via drill 0.6, 0.61)  (2 unrouted)
  Top 0.254: R6.1 42.1,111.48 v42.1,110.19 42.1,107.38 42.75,106.73 42.75,101.12 42.1,100.47 40.8,100.47 35.84,105.44 35.41,105.44 IC1.24 | v15.54,17.35 13.39,17.35 IC2.31 | v22.45,98.53 21.81,97.88 19.21,97.88 IC1.6 | 26.99,13.68 IC2.16 | v34.54,96.16 33.47,96.16 IC1.17 | 46.5,95.94 v45.12,95.94 | CN2.33 33.9,31.38 33.8,31.3 | JP7.1 39.5,4.77 39.5,1
  Top 0.5: 40.5,117.9 40.6,118 | 1.44,17.44 v1,17 | 1.13,13.63 1,13.5 | 27.1,118.2 29.3,118
  Top 0.8: 27.1,118.2 IC1.34 27.1,108.1 v27,108 | v40.6,89.5 42,89.5 | v23.75,13.68 26.99,13.68
  Top 1: v1,88.5 1.25,88.25 X1.53 X1.51 | 57.87,1.13 61.5,1.1 | 61.5,1.1 67.99,1.05 | 67.99,1.05 v74,1 74.19,1.19 | 1.27,107.27 1,107 | 20.85,117.85 v27.5,118 | 1,103.73 1,104 | 68,1.06 67.99,1.05 | 61,1.1 61.5,1.1 | 1.23,103.73 1,103.5 | 1,102.5 1.23,102.73 JP6.3 JP6.2 | CN1.33 CN1.31 CN1.29 CN1.27 CN1.25 CN1.23 CN1.21 CN1.19 CN1.17 CN1.15 CN1.13 CN1.11 CN1.9 CN1.7 CN1.5 CN1.3 CN1.1 42,74.77 42,81 43.73,82.73 JP5.3 JP5.2 43.73,85.27 42,87 42,89.5 46.5,93 46.5,95.94 46.5,118 | 44.8,31.4 44.7,31.4 44.7,28.8 | CN2.33 CN2.31 CN2.29 CN2.27 CN2.25 CN2.23 CN2.21 CN2.19 CN2.17 CN2.15 CN2.13 CN2.11 CN2.9 CN2.7 CN2.5 CN2.3 CN2.1 | 33.8,31.3 33.8,30.6 35.6,28.8 44.7,28.8 | 44.7,28.8 45.5,28.8 45.5,1 | 1.13,13.63 5.5,13.63 C7.-
  Top 1.5: v112.5,118 v61.5,118 46.5,118 40.6,118 29.3,118 v27.5,118 v1,118 1,107 1,104 1,103.5 1,102.5 v1,88.5 v1,17 1,13.5 1,1 v20,1 39.5,1 45.5,1 v74,1 v112.5,1
  Bottom 0.254: 42.75,110.19 42.75,111.7 C2.1 | 42.75,110.19 42.75,95.94 | v42.1,110.19 42.75,110.19 | 33.25,96.16 33.25,94.43 31.09,92.27 31.09,89.5 | 33.25,96.16 33.25,99.75 32,101 24.92,101 v22.45,98.53 | 20,83.42 17.49,83.42 IC3.5 | 33.25,96.16 v34.54,96.16 | v45.12,95.94 42.75,95.94 | 42.75,95.94 C1.1 | v15.54,17.35 17.15,17.35 18.1,16.4 19,16.4 19.3,16.7 22.2,16.7 23.2,15.7 23.2,13.68
  Bottom 0.5: 33.45,117.95 33.5,118
  Bottom 0.8: 20,80.5 20,83.42 20,86 18.75,87.25 IC3.8 19.68,89.5 31.09,89.5 v40.6,89.5 33.12,89.5 IC4.7 32.69,87.31 33,87 33,86 | 20,80.5 20,74.85 C5.2 | 33,86 33,84.5 | 33,84.5 33,82 | 33,82 33,80.5 | 33,80.5 33,76.25 C6.2 | IC4.9 33.04,86.04 33,86 | IC3.3 19.61,80.89 20,80.5 | IC4.13 33.46,80.96 33,80.5 | IC4.3 32.77,82.23 33,82 | IC4.5 32.73,84.77 33,84.5 | 20.08,13.46 20.08,12.1 21.37,11.31 25.83,8.35 25.83,1 | v23.75,13.68 23.2,13.68 20.03,13.68 | v27,108 C3.1
  Bottom 1.2: v112.5,1 25.83,1 1,1 v1,118 v27.5,118 33.5,118 v112.5,118
HS  (via drill 0.61)
  Top 0.254: v37.13,110.62 35.41,110.62 IC1.28 | v39.73,97.45 39.73,96.37 34.98,91.62 34.98,35.27 36.27,33.98 CN2.32
  Bottom 0.254: v37.13,110.62 37.13,101.34 39.73,98.75 v39.73,97.45
  Bottom 0.5: CN2.32 CN1.32
IDX  (via drill 0.61)
  Top 0.254: R5.2 27.42,64.42 27.42,65.28 v28.07,65.93 26.56,67.44 v26.56,75.86 | v27.85,87.52 v27.85,92.27 | IC1.43 19.21,106.73 21.27,106.73 21.5,106.5 24,106.5 29,101.5 29,98.18 v29.08,98.1
  Bottom 0.254: v28.07,65.93 33.25,65.93 33.68,65.5 34.98,65.5 36.05,64.42 CN2.8 | v27.85,92.27 27.85,94.64 29.58,96.37 29.58,97.6 v29.08,98.1 | v27.85,87.52 27.85,85.36 28.5,84.71 28.5,77.8 v26.56,75.86
  Bottom 0.5: CN2.8 CN1.8
LDOR  (via drill 0.61)
  Top 0.254: v27.64,84.28 27.64,86.01 31.09,89.46 31.09,92.27 32.38,93.56 35.19,93.56 38,96.37 38,97.23 37.57,97.67 35.41,97.67 IC1.18
  Bottom 0.254: v27.64,84.28 24.4,81.04 23.75,81.04 IC3.14
MOTA
  Bottom 0.254: 43.61,19.94 44.69,18.86 44.69,14.98 43.61,13.9 41.67,13.9 40.37,12.6 39.51,12.6 JP3.3 | 43.61,19.94 42.75,19.94 42.32,19.51 42.32,17.57 JP4.1 | 43.61,19.94 46.85,23.18 46.85,56.21 45.12,57.94 44.48,57.94 43.61,58.8 43.61,59.45 42.1,60.96 42.1,61.61 CN1.10
  Bottom 0.5: CN2.10 CN1.10
MOTB  (via drill 0.61)
  Top 0.254: v31.3,54.92 31.3,51.9 31.52,51.68 31.52,28.15 29.36,25.99 29.36,16.49 30.87,14.98 30.87,11.31 32.17,10.01 33.9,10.01 36.27,12.39 JP2.3
  Bottom 0.254: JP2.3 36.27,12.6 35.41,12.6 34.11,13.9 31.95,13.9 31.3,14.54 31.3,15.62 33.03,17.35 JP1.1 | v31.3,54.92 31.74,55.35 34.33,55.35 35.41,54.27 36.05,54.27 CN2.16
  Bottom 0.5: CN2.16 CN1.16
N$1  (via drill 0.61)
  Top 0.254: v28.71,88.38 28.71,90.76 32.82,94.86 32.82,98.75 34.33,100.26 35.19,100.26 IC1.20
  Bottom 0.254: v28.71,88.38 28.93,88.17 28.93,82.34 30.23,81.04 30.87,81.04 IC4.2
N$2  (via drill 0.61)
  Top 0.254: v31.95,98.1 31.95,104.36 33.25,105.66 v33.25,106.95 | v38.86,86.01 v38.86,90.76
  Bottom 0.254: v31.95,98.1 29.58,95.72 29.58,92.7 27.85,90.97 20.08,90.97 17.49,88.38 16.62,88.38 15.98,87.73 15.98,85.58 16.84,84.71 17.27,84.71 IC3.6 | v33.25,106.95 33.25,104.36 38,99.61 38,97.88 38.43,97.45 38.43,93.35 38.86,92.92 v38.86,90.76 | v38.86,86.01 37.78,84.93 37.13,84.93 IC4.10
N$3
  Top 0.254: X1.54 9.07,88.38 9.07,90.54 X1.56
N$4
  Bottom 0.5: CN2.2 CN1.2
N$6
  Top 0.254: IC2.2 10.13,13.63 9.5,13 9.5,9.45 11.95,7 20.5,7 20.95,6.55 R7.2 21.45,5.5 JP7.2
N$7
  Bottom 0.5: CN2.4 CN1.4
N$8
  Bottom 0.5: CN2.6 CN1.6
PVCAL
  Top 0.254: R6.2 41.88,113.43 41.24,113.43 37.13,109.33 35.41,109.33 IC1.27
RD  (via drill 0.61)
  Top 0.254: v20.94,103.71 20.51,104.14 19.21,104.14 IC1.1 | v16.41,99.18 14.68,99.18 13.39,97.88 13.39,97.23 11.66,95.51 11.66,85.14 12.95,83.85 v12.95,78.02 | v7.12,72.41 7.12,62.69 v6.48,62.04
  Bottom 0.254: v12.95,78.02 12.95,75.64 9.28,71.97 7.56,71.97 v7.12,72.41 | v6.48,62.04 6.48,60.1 6.04,59.67 6.04,57.51 7.77,55.78 7.77,51.9 8.85,50.82 X1.24 | v16.41,99.18 v20.94,103.71
RDD  (via drill 0.61)
  Top 0.254: v29.79,36.35 27.42,36.35 R2.2 | v38,77.16 38,91.19 40.59,93.78 40.59,97.88 36.92,101.55 35.41,101.55 IC1.21 | v37.57,75 37.57,66.58 38.21,65.93 38.21,38.29 36.49,36.57 CN2.30
  Bottom 0.254: v29.79,36.35 32.38,36.35 33.47,35.27 34.76,35.27 36.05,36.57 CN2.30 | v38,77.16 38,75.43 v37.57,75
  Bottom 0.5: CN2.30 CN1.30
RESET  (via drill 0.61)
  Top 0.254: v30.87,75.86 30.87,59.67 26.34,55.13 v25.04,55.13 | v19.86,55.35 15.98,55.35 11.87,59.45 8.42,59.45 5.61,56.65 5.61,50.38 v5.4,50.17
  Bottom 0.254: v30.87,75.86 30.87,79.53 IC4.1 | v25.04,55.13 20.08,55.13 v19.86,55.35 | v5.4,50.17 5.4,50.82 5.18,51.03 5.18,52.11 4.1,53.19 X1.25
SELA
  Bottom 0.254: 35.19,18.65 31.95,18.65 30.87,17.57 30.87,14.33 32.6,12.6 33.03,12.6 JP1.3 | 35.19,18.65 36.27,17.57 JP2.1 | 35.19,18.65 45.99,29.44 45.99,46.93 45.12,47.79 44.48,47.79 43.61,48.66 43.61,54.49 42.32,55.78 42.32,56.65 CN1.14
  Bottom 0.5: CN2.14 CN1.14
SELB
  Top 0.254: JP4.3 42.53,12.6 44.26,14.33 44.26,15.62 43.4,16.49 40.37,16.49 39.51,17.35 JP3.1
  Bottom 0.254: CN1.12 42.32,59.24 42.32,58.16 43.61,56.86 43.61,56.43 44.69,55.35 45.12,55.35 46.42,54.05 46.42,24.48 39.51,17.57 JP3.1
  Bottom 0.5: CN2.12 CN1.12
SLT3  (via drill 0.61)
  Top 0.254: v14.03,43.26 9.07,38.29 X1.14 | v22.89,34.41 22.89,20.59 IC2.23
  Bottom 0.254: IC3.4 17.27,82.12 16.62,82.12 15.11,80.61 15.11,70.25 14.9,70.03 14.9,62.91 16.19,61.61 16.19,55.78 13.6,53.19 13.6,43.69 v14.03,43.26 v22.89,34.41
STEP  (via drill 0.61)
  Top 0.254: v29.79,109.97 29.79,112.13 IC1.32 | v31.95,90.76 31.95,78.23 30.01,76.29 v30.01,71.54 | v37.35,65.5 37.35,50.17 36.49,49.3 CN2.20
  Bottom 0.254: v29.79,109.97 29.79,105.87 36.27,99.39 36.27,92.05 36.7,91.62 36.7,90.76 36.27,90.33 32.38,90.33 v31.95,90.76 | v30.01,71.54 33.47,68.09 34.11,68.09 35.19,67.01 35.19,66.36 36.05,65.5 v37.35,65.5
  Bottom 0.5: CN2.20 CN1.20
STEPDIR  (via drill 0.6, 0.61)
  Top 0.254: v17.06,93.13 17.06,84.28 23.75,77.59 23.75,64.42 24.4,63.77 v24.4,60.75 | IC1.31 30.87,112.13 30.87,102.87 v30.5,102.5
  Bottom 0.254: v17.06,93.13 18.14,94.21 18.14,97.23 20.73,99.83 22.82,99.83 25,102 30,102 v30.5,102.5 | v24.4,60.75 28.93,56.21 28.93,56 32.17,52.76 34.98,52.76 36.05,51.68 CN2.18
  Bottom 0.5: CN2.18 CN1.18
TR0  (via drill 0.6, 0.61)
  Top 0.254: v27.42,43.26 27.42,41.75 R4.2 | v34.11,91.19 34.11,73.92 32.38,72.19 v32.38,65.06 | v43.4,60.96 43.4,42.83 42.32,41.75 CN1.26 | IC1.42 19.21,108.03 21.03,108.03 21.5,108.5 23,108.5 v24,109.5
  Bottom 0.254: v27.42,43.26 33.03,43.26 33.68,42.61 34.98,42.61 36.05,41.53 CN2.26 | v34.11,91.19 35.41,92.48 35.41,98.96 28.5,105.87 28.5,108.5 27.5,109.5 v24,109.5 | v32.38,65.06 32.38,64.2 33.68,62.91 42.75,62.91 43.4,62.26 v43.4,60.96
  Bottom 0.5: CN2.26 CN1.26
WD  (via drill 0.61)
  Top 0.254: v32.38,108.68 32.38,112.13 IC1.30 | v38,92.48 38,91.84 37.13,90.97 v37.13,88.38 | v40.59,85.79 40.59,75.21 41.02,74.78 41.02,47.79 42.1,46.71 CN1.22
  Bottom 0.254: v32.38,108.68 32.38,106.52 32.82,106.09 32.82,104.14 37.57,99.39 37.57,97.67 38,97.23 v38,92.48 | v37.13,88.38 38,88.38 v40.59,85.79
  Bottom 0.5: CN2.22 CN1.22
WE  (via drill 0.61)
  Top 0.254: v31.95,105.66 31.95,106.95 33.25,108.25 33.25,112.13 IC1.29 | v37.13,96.8 34.76,94.43 v34.54,94.43 | v32.82,92.7 32.82,73.27 31.3,71.76 31.3,59.24 28.07,56 v28.07,50.82
  Bottom 0.254: v31.95,105.66 31.95,104.36 37.13,99.18 v37.13,96.8 | v32.82,92.7 v34.54,94.43 | v28.07,50.82 33.68,45.2 34.98,45.2 36.05,44.12 CN2.24
  Bottom 0.5: CN2.24 CN1.24
WP  (via drill 0.61)
  Top 0.254: v29.79,38.94 28.5,38.94 | 28.5,38.94 27.42,38.94 R3.2 | v16.41,107.6 17.92,109.11 19,109.11 IC1.41 | v14.46,97.67 12.09,95.29 12.09,85.36 13.82,83.63 13.82,78.45 17.92,74.35 17.92,66.58 23.32,61.18 v23.32,48.66 | v25.04,46.93 28.5,43.48 28.5,38.94
  Bottom 0.254: v29.79,38.94 32.17,38.94 33.25,37.86 34.98,37.86 36.05,38.94 CN2.28 | v16.41,107.6 14.46,105.66 v14.46,97.67 | v25.04,46.93 v23.32,48.66
  Bottom 0.5: CN2.28 CN1.28
WR
  Top 0.254: IC1.2 19,102.85 16.41,102.85 12.52,98.96 12.52,97.67 10.58,95.72 10.58,85.79 9.28,84.5 8.64,84.5 6.04,81.91 6.04,73.7 4.32,71.97 3.45,71.97 2.81,71.33 2.81,62.69 3.45,62.04 4.32,62.04 5.18,61.18 5.18,51.9 4.1,50.82 X1.23
XT1A
  Top 0.254: IC1.25 35.41,106.73 36.49,106.73 41.67,101.55 Q1.2
  Bottom 0.254: C1.2 40.8,95.94 40.8,100.47 41.67,101.34 Q1.2
XT1B
  Top 0.254: IC1.26 35.41,107.81 40.37,107.81 41.67,106.52 Q1.1
  Bottom 0.254: C2.2 40.8,111.7 40.8,107.38 41.67,106.52 Q1.1
(copper drawn outside any net)
  shapes: Bottom circle x4, Top circle x4

### Text on the board
tNames: RBSC | 2018 | Russian Bear Service Crew | PWR | +12V | GND | GND | +5V | PWR | GOTEK | CFG TABLE | NC | A+B | GND | B+A | GND | +5V | A | Version 1.1 | For floppy cable only! | For direct connection to Gotek only! | JP CFG | + | See the CFG table | above for options | RBSC | GOTEK Adapter Module | 2018
bNames: RBSC | 2018 | Russian Bear Service Crew | Version 1.1 | RBSC | GOTEK Adapter Module | 2018